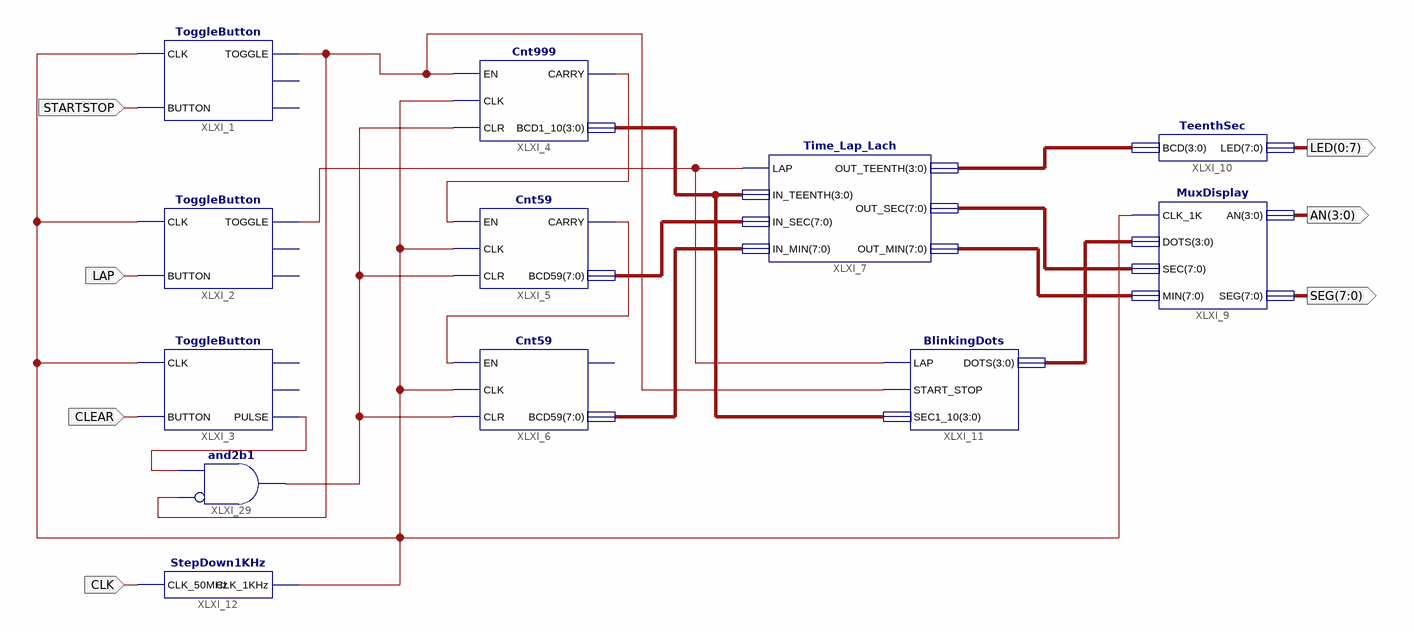
[diagram p0: schematic sheet 1]
// Xilinx ISE schematic Assemble.sch (spartan3e) as structural Verilog: 12 symbols, 7 ports
module Assemble (
  input  STARTSTOP,
  input  LAP,
  input  CLEAR,
  input  CLK,
  output [0:7] LED,
  output [3:0] AN,
  output [7:0] SEG
);

  wire XLXN_24, XLXN_31, XLXN_54, XLXN_55, XLXN_63, XLXN_65, XLXN_67;
  wire [3:0] XLXN_57, XLXN_72, XLXN_75;
  wire [7:0] XLXN_58, XLXN_59, XLXN_73, XLXN_74;

  ToggleButton XLXI_1 (.CLK(XLXN_54), .BUTTON(STARTSTOP), .TOGGLE(XLXN_31));  // open: DEBOUNCE, PULSE
  ToggleButton XLXI_2 (.CLK(XLXN_54), .BUTTON(LAP), .TOGGLE(XLXN_55));  // open: DEBOUNCE, PULSE
  ToggleButton XLXI_3 (.CLK(XLXN_54), .BUTTON(CLEAR), .PULSE(XLXN_24));  // open: TOGGLE, DEBOUNCE
  Cnt999 XLXI_4 (.EN(XLXN_31), .CLK(XLXN_54), .CLR(XLXN_67), .CARRY(XLXN_63), .BCD1_10(XLXN_72));
  Cnt59 XLXI_5 (.EN(XLXN_63), .CLK(XLXN_54), .CLR(XLXN_67), .CARRY(XLXN_65), .BCD59(XLXN_73));
  Time_Lap_Lach XLXI_7 (
    .LAP(XLXN_55), .IN_TEENTH(XLXN_72), .IN_SEC(XLXN_73), .IN_MIN(XLXN_74), .OUT_TEENTH(XLXN_75),
    .OUT_SEC(XLXN_58), .OUT_MIN(XLXN_59));
  TeenthSec XLXI_10 (.BCD(XLXN_75), .LED(LED));
  MuxDisplay XLXI_9 (.CLK_1K(XLXN_54), .DOTS(XLXN_57), .SEC(XLXN_58), .MIN(XLXN_59), .AN(AN), .SEG(SEG));
  BlinkingDots XLXI_11 (.LAP(XLXN_55), .START_STOP(XLXN_31), .SEC1_10(XLXN_72), .DOTS(XLXN_57));
  StepDown1KHz XLXI_12 (.CLK_50MHz(CLK), .CLK_1KHz(XLXN_54));
  and XLXI_29 (XLXN_67, ~XLXN_31, XLXN_24);  // and2b1
  Cnt59 XLXI_6 (.EN(XLXN_65), .CLK(XLXN_54), .CLR(XLXN_67), .BCD59(XLXN_74));  // open: CARRY
endmodule
